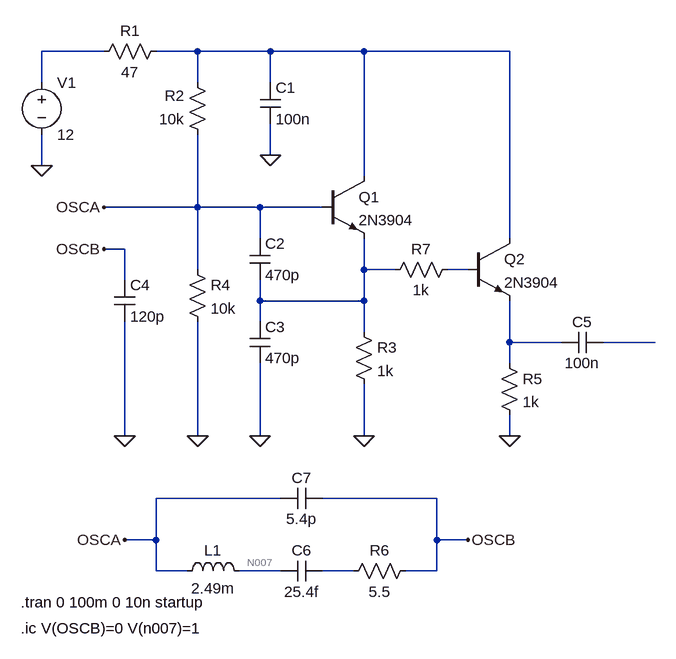
[diagram p0: schematic G3UUR.asc]
G3UUR.asc, the LTspice schematic file:
Version 4
SHEET 1 1028 1040
WIRE 112 80 16 80
WIRE 256 80 192 80
WIRE 368 80 256 80
WIRE 512 80 368 80
WIRE 736 80 512 80
WIRE 16 128 16 80
WIRE 256 128 256 80
WIRE 368 128 368 80
WIRE 368 240 368 192
WIRE 16 256 16 208
WIRE 512 272 512 80
WIRE 256 320 256 208
WIRE 256 320 112 320
WIRE 352 320 256 320
WIRE 448 320 352 320
WIRE 352 368 352 320
WIRE 736 368 736 80
WIRE 144 384 112 384
WIRE 256 416 256 320
WIRE 512 416 512 368
WIRE 560 416 512 416
WIRE 672 416 640 416
WIRE 144 432 144 384
WIRE 352 464 352 432
WIRE 512 464 512 416
WIRE 512 464 352 464
WIRE 352 496 352 464
WIRE 512 512 512 464
WIRE 736 528 736 464
WIRE 816 528 736 528
WIRE 960 528 880 528
WIRE 736 560 736 528
WIRE 144 672 144 496
WIRE 256 672 256 496
WIRE 352 672 352 560
WIRE 512 672 512 592
WIRE 736 672 736 640
WIRE 384 768 192 768
WIRE 624 768 448 768
WIRE 192 832 192 768
WIRE 192 832 144 832
WIRE 624 832 624 768
WIRE 672 832 624 832
WIRE 192 880 192 832
WIRE 240 880 192 880
WIRE 384 880 320 880
WIRE 496 880 448 880
WIRE 624 880 624 832
WIRE 624 880 576 880
FLAG 512 672 0
FLAG 352 672 0
FLAG 736 672 0
FLAG 256 672 0
FLAG 144 832 OSCA
FLAG 672 832 OSCB
FLAG 112 320 OSCA
FLAG 112 384 OSCB
FLAG 144 672 0
FLAG 368 240 0
FLAG 16 256 0
SYMBOL res 208 64 R90
WINDOW 0 0 56 VBottom 2
WINDOW 3 32 56 VTop 2
SYMATTR InstName R1
SYMATTR Value 47
SYMBOL res 272 224 R180
WINDOW 0 36 76 Left 2
WINDOW 3 36 40 Left 2
SYMATTR InstName R2
SYMATTR Value 10k
SYMBOL cap 352 128 R0
SYMATTR InstName C1
SYMATTR Value 100n
SYMBOL npn 448 272 R0
SYMATTR InstName Q1
SYMATTR Value 2N3904
SYMBOL res 496 496 R0
SYMATTR InstName R3
SYMATTR Value 1k
SYMBOL cap 336 368 R0
SYMATTR InstName C2
SYMATTR Value 470p
SYMBOL cap 336 496 R0
SYMATTR InstName C3
SYMATTR Value 470p
SYMBOL res 240 400 R0
SYMATTR InstName R4
SYMATTR Value 10k
SYMBOL cap 128 432 R0
SYMATTR InstName C4
SYMATTR Value 120p
SYMBOL npn 672 368 R0
SYMATTR InstName Q2
SYMATTR Value 2N3904
SYMBOL res 720 544 R0
SYMATTR InstName R5
SYMATTR Value 1k
SYMBOL cap 880 512 R90
WINDOW 0 0 32 VBottom 2
WINDOW 3 32 32 VTop 2
SYMATTR InstName C5
SYMATTR Value 100n
SYMBOL res 592 864 R90
WINDOW 0 0 56 VBottom 2
WINDOW 3 32 56 VTop 2
SYMATTR InstName R6
SYMATTR Value 5.5
SYMBOL cap 448 864 R90
WINDOW 0 0 32 VBottom 2
WINDOW 3 32 32 VTop 2
SYMATTR InstName C6
SYMATTR Value 25.4f
SYMBOL ind 224 896 R270
WINDOW 0 32 56 VTop 2
WINDOW 3 5 56 VBottom 2
SYMATTR InstName L1
SYMATTR Value 2.49m
SYMBOL cap 448 752 R90
WINDOW 0 0 32 VBottom 2
WINDOW 3 32 32 VTop 2
SYMATTR InstName C7
SYMATTR Value 5.4p
SYMBOL voltage 16 112 R0
WINDOW 123 0 0 Left 0
WINDOW 39 0 0 Left 0
SYMATTR InstName V1
SYMATTR Value 12
SYMBOL res 656 400 R90
WINDOW 0 0 56 VBottom 2
WINDOW 3 32 56 VTop 2
SYMATTR InstName R7
SYMATTR Value 1k
TEXT -16 928 Left 2 !.tran 0 100m 0 10n startup
TEXT -16 968 Left 2 !.ic V(OSCB)=0 V(n007)=1

The netlist it stands for:
* G3UUR.asc
R1 N002 N001 47
R2 OSCA N002 10k
C1 N002 0 100n
Q1 N002 OSCA N003 0 2N3904
R3 N003 0 1k
C2 OSCA N003 470p
C3 N003 0 470p
R4 OSCA 0 10k
C4 OSCB 0 120p
Q2 N002 N004 N005 0 2N3904
R5 N005 0 1k
C5 N006 N005 100n
R6 OSCB N008 5.5
C6 N008 N007 25.4f
L1 OSCA N007 2.49m
C7 OSCB OSCA 5.4p
V1 N001 0 12
R7 N004 N003 1k
.model NPN NPN
.model PNP PNP
.lib standard.bjt
.tran 0 100m 0 10n startup
.ic V(OSCB)=0 V(n007)=1
.backanno
.end